# EAGLE design XIAO ESP32S3_v1.1 (EAGLE 9.6.2)
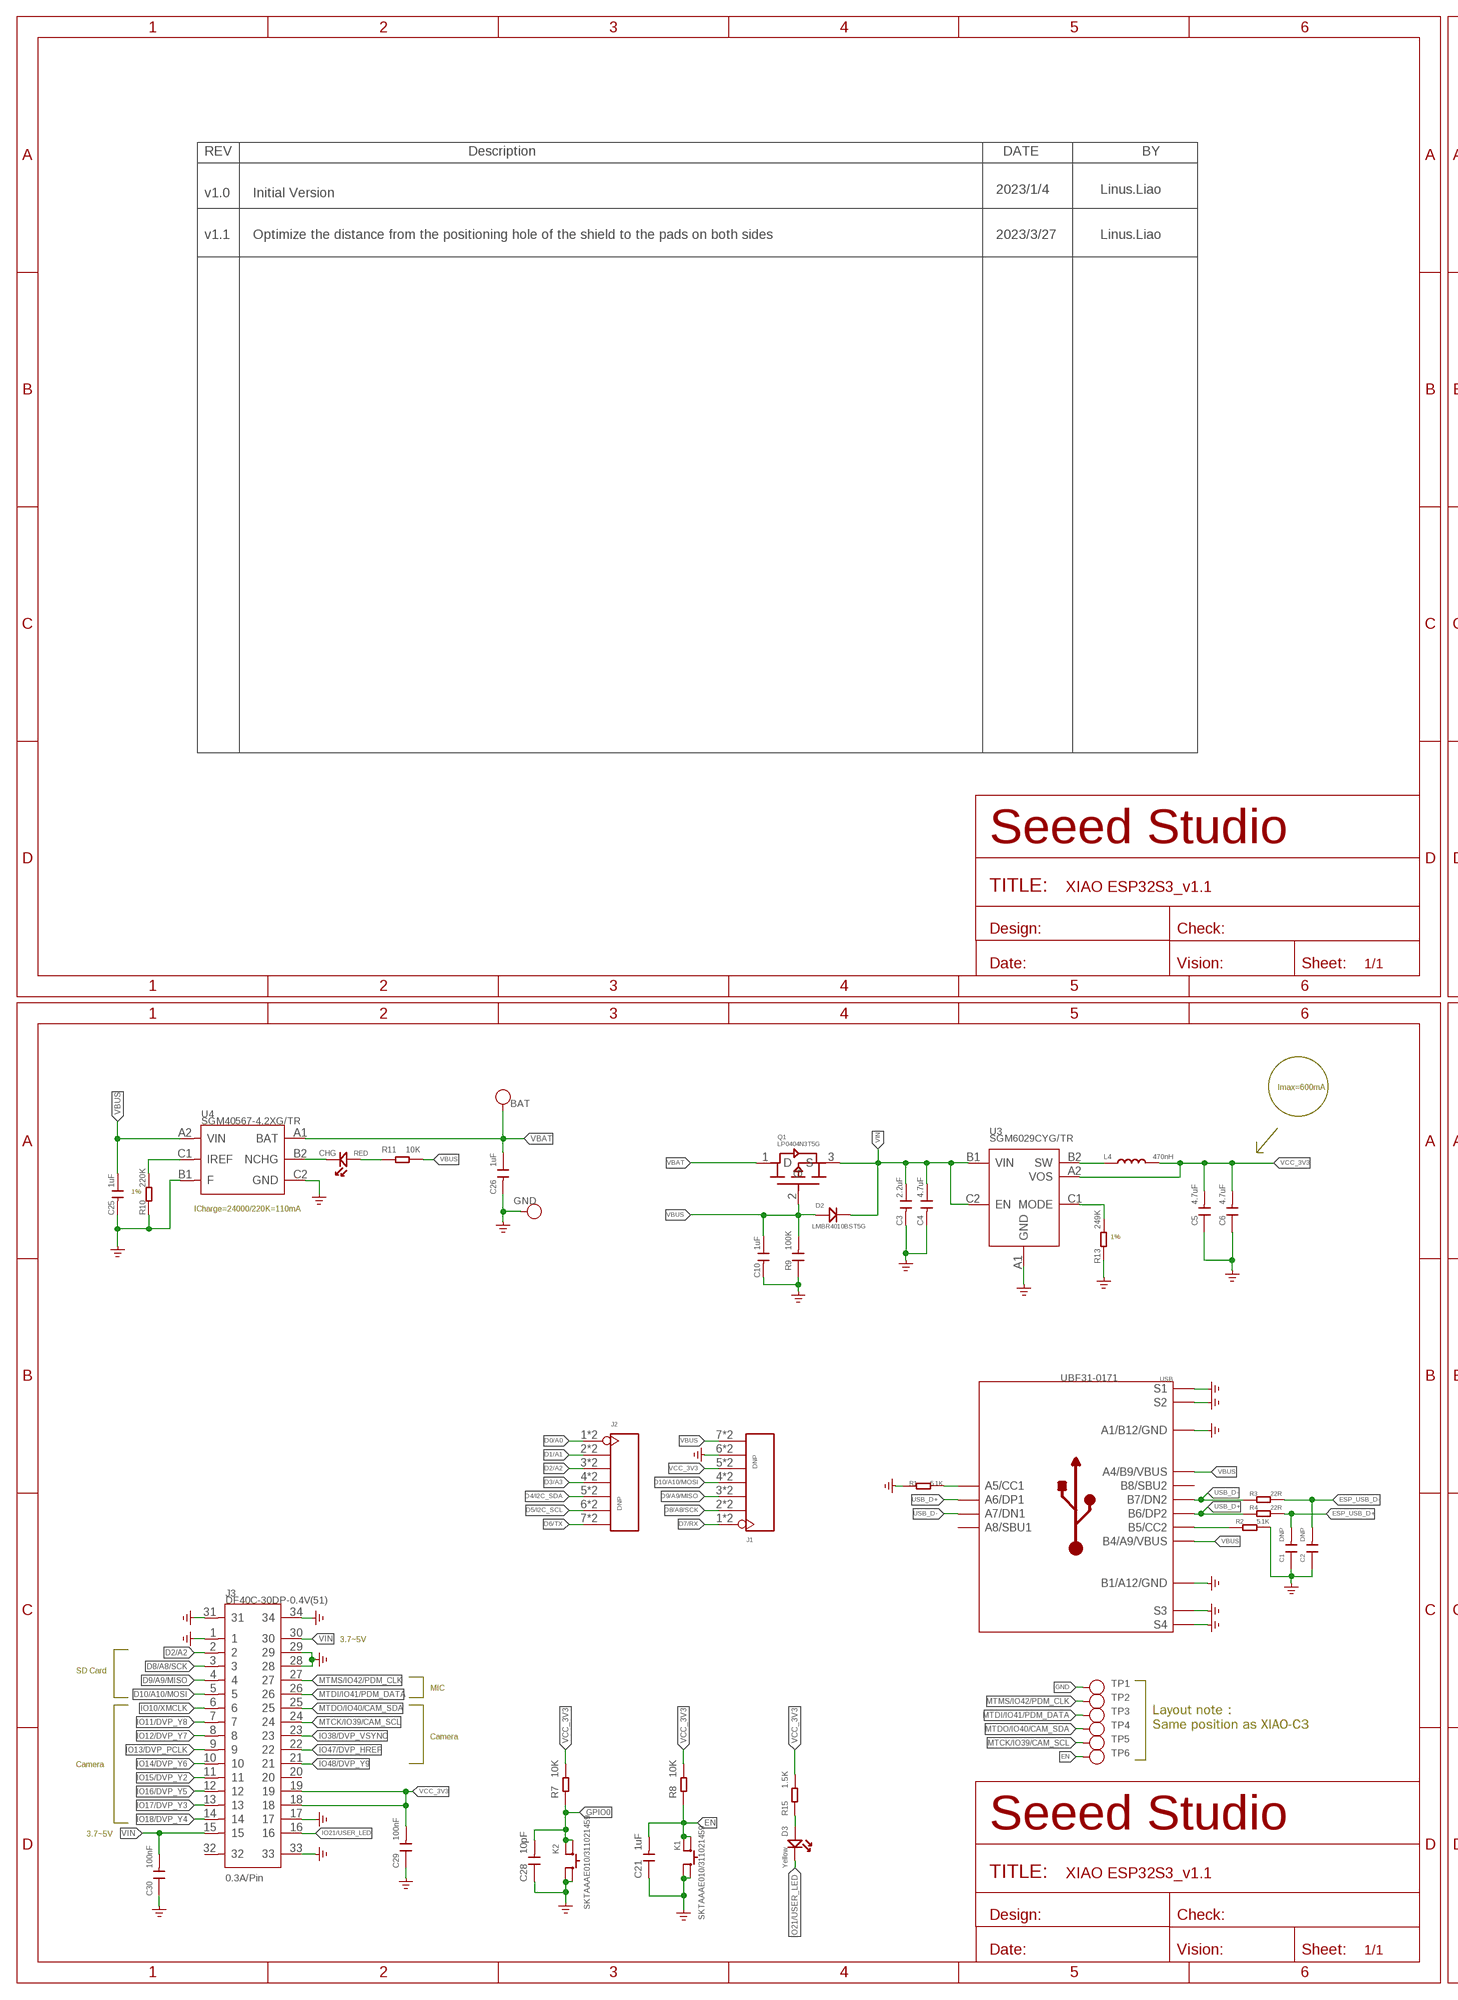
[diagram p0: schematic, sheet 1, part 1 of 2]
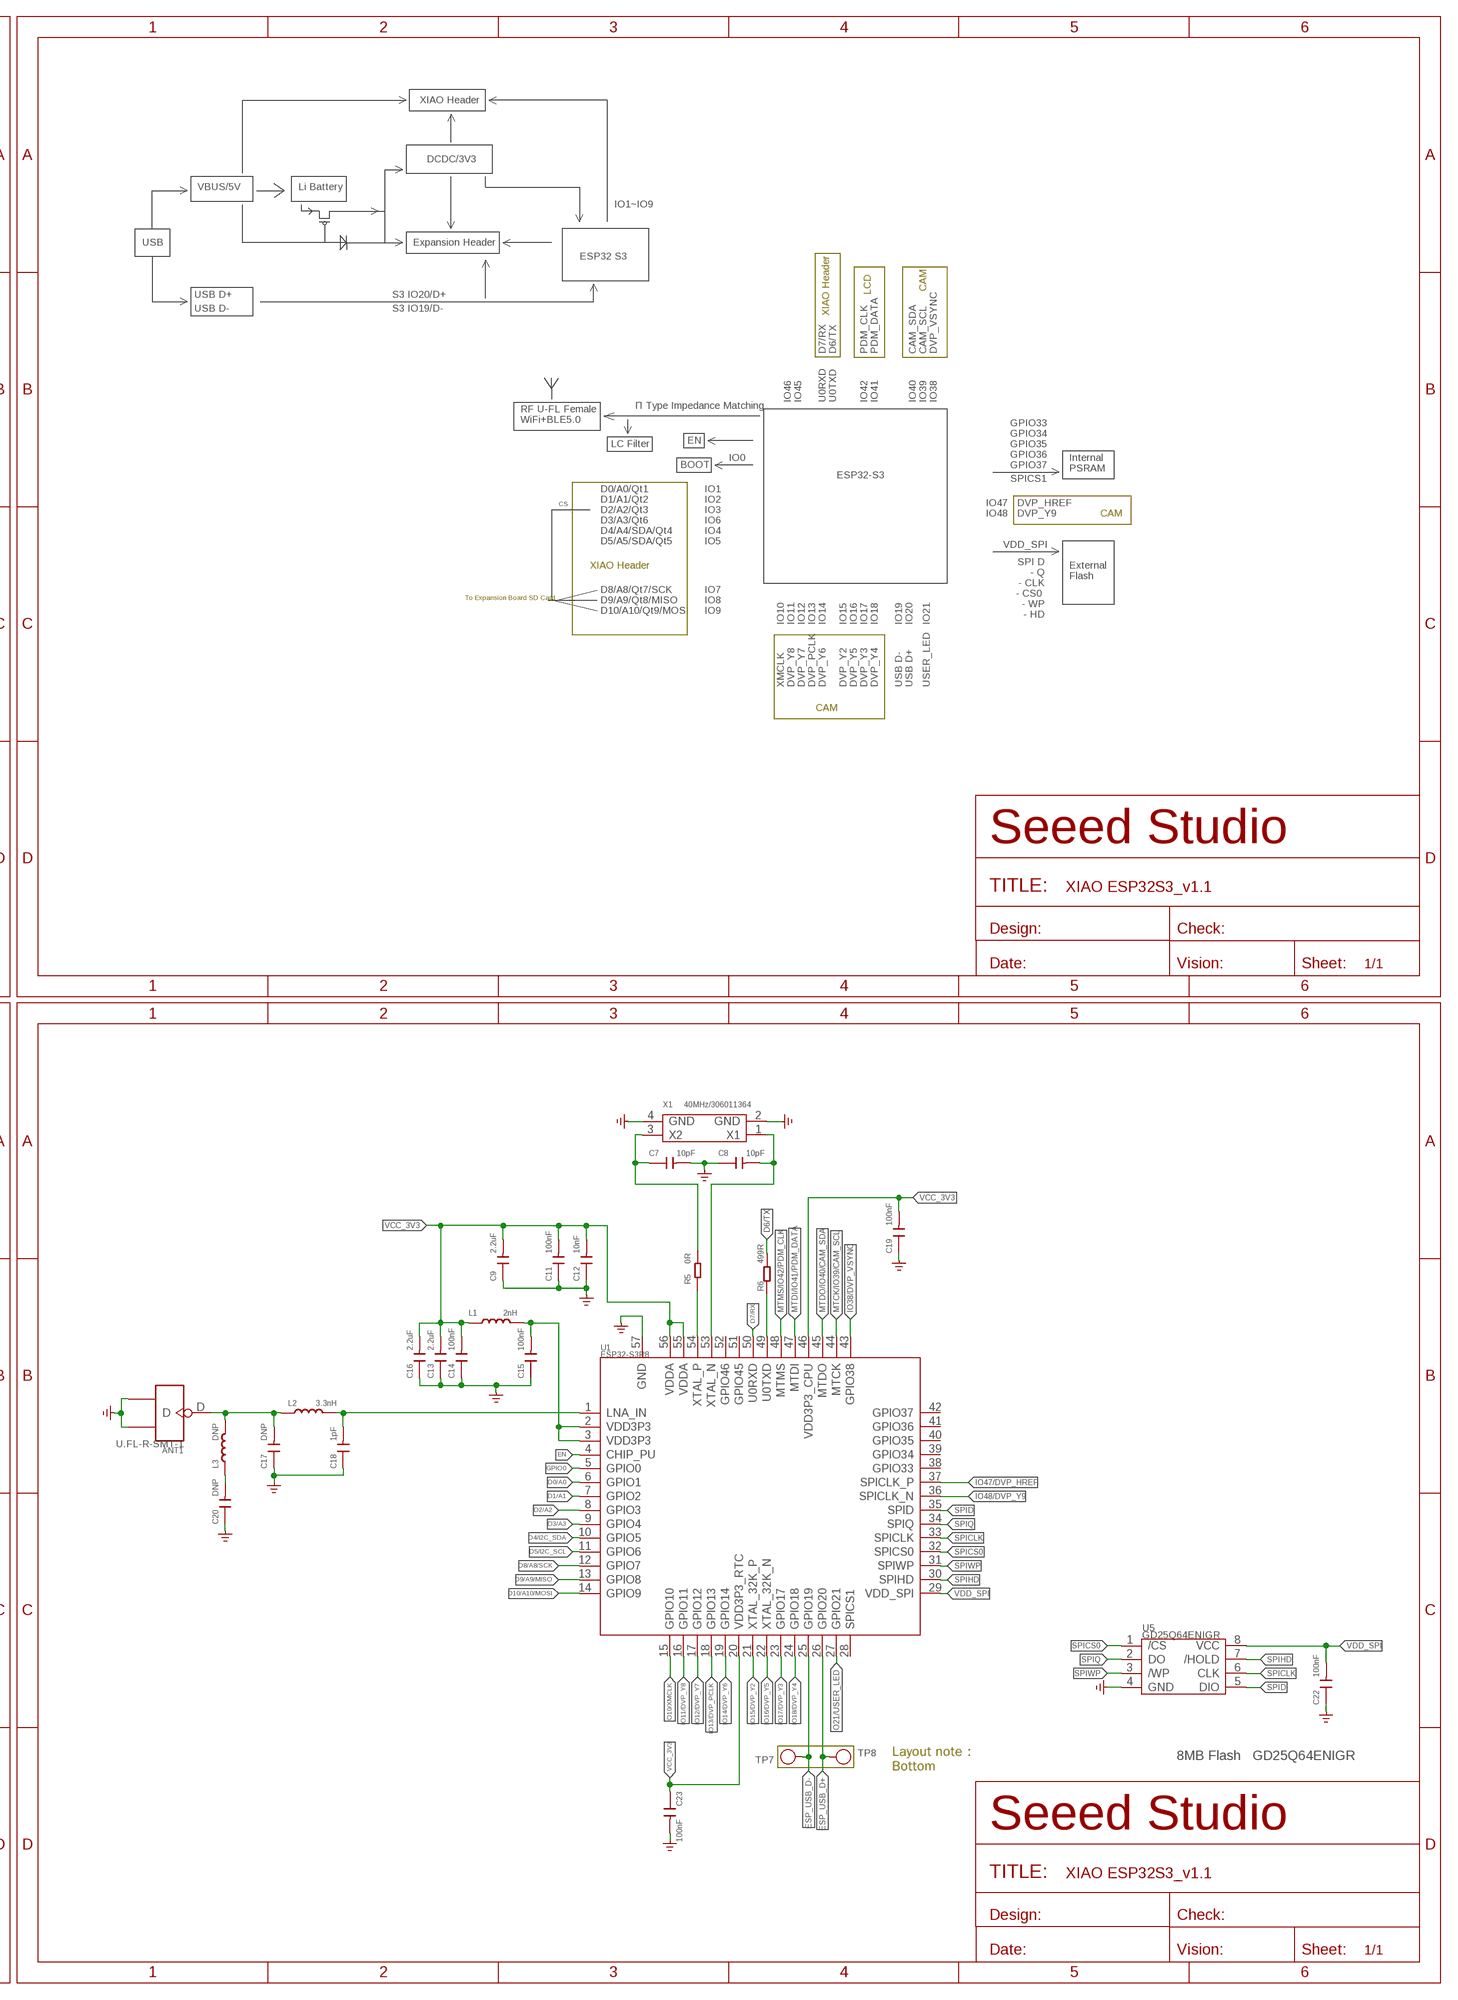
[diagram p1: schematic, sheet 1, part 2 of 2]

## Parts
ANT1  U.FL-R-SMT-1  ANTENNA-U-FL-320110048  [U-FL3P-SMD-2.6X2.6X1.0MM]
BAT  VBAT  TEST-POINT'4080'  [TP-80X40MIL]
C1  DNP  CAP-0201  [C0201]
C2  DNP  CAP-0201  [C0201]
C3  2.2uF  CAP-0201  [C0201]
C4  4.7uF  CAP-0201  [C0201]
C5  4.7uF  CAP-0201  [C0201]
C6  4.7uF  CAP-0201  [C0201]
C7  10pF  CAP-0201  [C0201]
C8  10pF  CAP-0201  [C0201]
C9  2.2uF  CAP-0201  [C0201]
C10  1uF  CAP-0201  [C0201]
C11  100nF  CAP-0201  [C0201]
C12  10nF  CAP-0201  [C0201]
C13  2.2uF  CAP-0201  [C0201]
C14  100nF  CAP-0201  [C0201]
C15  100nF  CAP-0201  [C0201]
C16  2.2uF  CAP-0201  [C0201]
C17  DNP  CAP-0201  [C0201]
C18  1pF  CAP-0201  [C0201]
C19  100nF  CAP-0201  [C0201]
C20  DNP  CAP-0201  [C0201]
C21  1uF  CAP-0201  [C0201]
C22  100nF  CAP-0201  [C0201]
C23  100nF  CAP-0201  [C0201]
C25  1uF  CAP-0201  [C0201]
C26  1uF  CAP-0201  [C0201]
C28  10pF  CAP-0201  [C0201]
C29  100nF  CAP-0201  [C0201]
C30  100nF  CAP-0201  [C0201]
CHG  RED  LED-0402  [LED-0402]
D2  LMBR4010BST5G  DIODEDFN1006(0402/SOD882)  [DFN1006-2L]
D3  Yellow  LED-0402  [LED-0402]
GND  GND  TEST-POINT'4080'  [TP-80X40MIL]
J1  DNP  HEADER-7P-HALF-HOLE-2.54  [H7-HALF-HOLE-2.54]
J2  DNP  HEADER-7P-HALF-HOLE-2.54  [H7-HALF-HOLE-2.54]
J3  DF40C-30DP-0.4V(51)  BTB-P4S30-HEAD  [BTB30-0.4-7.52X2.97X1.14]
K1  SKTAAAE010/311021459  BUTTON-4P  [SW4-SMD-2.8-2.6X1.6X0.53MM]
K2  SKTAAAE010/311021459  BUTTON-4P  [SW4-SMD-2.8-2.6X1.6X0.53MM]
L1  2nH  INDUCTOR-0201  [L0201]
L2  3.3nH  INDUCTOR-0201  [L0201]
L3  DNP  INDUCTOR-0201  [L0201]
L4  470nH  L-0603  [L0603]
Q1  LP0404N3T5G  PMOS_1.00.60.35MM  [PMOS_1.0*0.6*0.35MM]
R1  5.1K  RES-0201  [R0201]
R2  5.1K  RES-0201  [R0201]
R3  22R  RES-0201  [R0201]
R4  22R  RES-0201  [R0201]
R5  0R  RES-0201  [R0201]
R6  499R  RES-0201  [R0201]
R7  10K  RES-0201  [R0201]
R8  10K  RES-0201  [R0201]
R9  100K  CAP-0201  [C0201]
R10  220K  RES-0201  [R0201]
R11  10K  RES-0201  [R0201]
R13  249K  RES-0201  [R0201]
R15  1.5K  RES-0201  [R0201]
TP1  TEST-POINT'4545'  [TP-D45MIL]
TP2  TEST-POINT'4545'  [TP-D45MIL]
TP3  TEST-POINT'4545'  [TP-D45MIL]
TP4  TEST-POINT'4545'  [TP-D45MIL]
TP5  TEST-POINT'4545'  [TP-D45MIL]
TP6  TEST-POINT'4545'  [TP-D45MIL]
TP7  TEST-POINT'4545'  [TP-D45MIL]
TP8  TEST-POINT'4545'  [TP-D45MIL]
U1  ESP32-S3R8  MCU-ESP32-S3  [QFN56G-0.4-7X7MM]
U3  SGM6029CYG/TR  PMIC-SGM6029  [BGA6-0.35-0.745X10.95X0.4MM]
U4  SGM40567-4.2XG/TR  PMIC-SGM40567  [WLCSP-0.4-0.92X1.16X0.4MM]
U5  GD25Q64ENIGR  FLASH-W25X80-FZBIHO  [USON8-0.8-4X3MM]
USB  UBF31-0171  USB2.0-TYPE-C  [USB2.0-TYPE-C]
X1  40MHz/306011364  CRYSTAL-4P-1612  [X4-SMD-1.6X1.2X0.35MM]

## Nets
D0/A0: J2.1 J2.13 U1.6(GPIO1)
D1/A1: J2.2 J2.14 U1.7(GPIO2)
D2/A2: J2.3 J2.15 J3.2 U1.8(GPIO3)
D3/A3: J2.4 J2.16 U1.9(GPIO4)
D4/I2C_SDA: J2.5 J2.17 U1.10(GPIO5)
D5/I2C_SCL: J2.6 J2.18 U1.11(GPIO6)
D6/TX: J2.7 J2.19 R6.2
D7/RX: J1.1 J1.13 U1.50(U0RXD)
D8/A8/SCK: J1.2 J1.14 J3.3 U1.12(GPIO7)
D9/A9/MISO: J1.3 J1.15 J3.4 U1.13(GPIO8)
D10/A10/MOSI: J1.4 J1.16 J3.5 U1.14(GPIO9)
EN: C21.2 K1.1(A0) K1.3(A1) R8.1 TP6.T U1.4(CHIP_PU)
ESP_USB_D+: C1.2 R4.2 TP8.T U1.26(GPIO20)
ESP_USB_D-: C2.2 R3.2 TP7.T U1.25(GPIO19)
GND: ANT1.GND1 ANT1.GND2 C1.1 C2.1 C3.2 C4.2 C5.1 C6.1 C7.2 C8.1 C9.1 C10.2 C11.1 C12.1 C13.1 C14.1 C15.1 C16.1 C17.1 C18.1 C19.1 C20.1 C21.1 C22.1 C23.2 C25.2 C26.2 C28.1 C29.1 C30.1 GND.1(T) J1.6 J1.18 J3.1 J3.17 J3.28 J3.29 J3.31 J3.33 J3.34 K1.2(B0) K1.4(B1) K2.2(B0) K2.4(B1) R1.1 R2.2 R9.1 R10.1 R13.1 TP1.T U1.57(GND) U3.A1(GND) U4.B1(F) U4.C2(GND) U5.4(GND) USB.A1_B12(A1/B12/GND) USB.B1_A12(B1/A12/GND) USB.S1 USB.S2 USB.S3 USB.S4 USB.S5(S1) USB.S6(S2) X1.2(GND) X1.4(GND) ; supply symbol labelled GND_POWER
GPIO0: C28.2 K2.1(A0) K2.3(A1) R7.1 U1.5(GPIO0)
IO10/XMCLK: J3.6 U1.15(GPIO10)
IO11/DVP_Y8: J3.7 U1.16(GPIO11)
IO12/DVP_Y7: J3.8 U1.17(GPIO12)
IO13/DVP_PCLK: J3.9 U1.18(GPIO13)
IO14/DVP_Y6: J3.10 U1.19(GPIO14)
IO15/DVP_Y2: J3.11 U1.21(XTAL_32K_P)
IO16/DVP_Y5: J3.12 U1.22(XTAL_32K_N)
IO17/DVP_Y3: J3.13 U1.23(GPIO17)
IO18/DVP_Y4: J3.14 U1.24(GPIO18)
IO21/USER_LED: D3.- J3.16 U1.27(GPIO21)
IO38/DVP_VSYNC: J3.23 U1.43(GPIO38)
IO47/DVP_HREF: J3.22 U1.37(SPICLK_P)
IO48/DVP_Y9: J3.21 U1.36(SPICLK_N)
MTCK/IO39/CAM_SCL: J3.24 TP5.T U1.44(MTCK)
MTDI/IO41/PDM_DATA: J3.26 TP3.T U1.47(MTDI)
MTDO/IO40/CAM_SDA: J3.25 TP4.T U1.45(MTDO)
MTMS/IO42/PDM_CLK: J3.27 TP2.T U1.48(MTMS)
N$1: R5.1 U1.54(XTAL_P)
N$2: C7.1 R5.2 X1.3(X2)
N$3: C8.2 U1.53(XTAL_N) X1.1(X1)
N$4: L4.1 U3.B2(SW)
N$5: ANT1.D C17.2 L2.1 L3.2
N$6: R2.1 USB.B5(B5/CC2)
N$7: C15.2 L1.2 U1.2(VDD3P3) U1.3(VDD3P3)
N$8: R1.2 USB.A5(A5/CC1)
N$9: C18.2 L2.2 U1.1(LNA_IN)
N$10: CHG.- U4.B2(NCHG)
N$11: R6.1 U1.49(U0TXD)
N$13: R10.2 U4.C1(IREF)
N$14: CHG.+ R11.2
N$15: D3.+ R15.1
N$16: R13.2 U3.C1(MODE)
N$28: C20.2 L3.1
SPICLK: U1.33(SPICLK) U5.6(CLK)
SPICS0: U1.32(SPICS0) U5.1(/CS)
SPID: U1.35(SPID) U5.5(DIO)
SPIHD: U1.30(SPIHD) U5.7(/HOLD)
SPIQ: U1.34(SPIQ) U5.2(DO)
SPIWP: U1.31(SPIWP) U5.3(/WP)
USB_D+: R4.1 USB.A6(A6/DP1) USB.B6(B6/DP2)
USB_D-: R3.1 USB.A7(A7/DN1) USB.B7(B7/DN2)
VBAT: BAT.1(T) C26.1 Q1.1(D) U4.A1(BAT)
VBUS: C10.1 C25.1 D2.+ J1.7 J1.19 Q1.2(G) R9.2 R11.1 U4.A2(VIN) USB.A4_B9(A4/B9/VBUS) USB.B4_A9(B4/A9/VBUS)
VCC_3V3: C5.2 C6.2 C9.2 C11.2 C12.2 C13.2 C14.2 C16.2 C19.2 C23.1 C29.2 J1.5 J1.17 J3.18 J3.19 L1.1 L4.2 R7.2 R8.2 R15.2 U1.20(VDD3P3_RTC) U1.46(VDD3P3_CPU) U1.55(VDDA) U1.56(VDDA) U3.A2(VOS)
VDD_SPI: C22.2 U1.29(VDD_SPI) U5.8(VCC)
VIN: C3.1 C4.1 C30.2 D2.- J3.15 J3.30 Q1.3(S) U3.B1(VIN) U3.C2(EN)
Unconnected: J3.20 J3.32 U1.28(SPICS1) U1.38(GPIO33) U1.39(GPIO34) U1.40(GPIO35) U1.41(GPIO36) U1.42(GPIO37) U1.51(GPIO45) U1.52(GPIO46) USB.A8(A8/SBU1) USB.B8(B8/SBU2)

## Notes on the sheet
- XIAO Header
- DCDC/3V3
- VBUS/5V | Li Battery
- v1.0 | Initial Version | 2023/1/4 | Linus.Liao
- IO1~IO9
- v1.1 | Optimize the distance from the positioning hole of the shield to the pads on both sides | 2023/3/27 | Linus.Liao
- USB | Expansion Header
- ESP32 S3
- CAM
- LCD
- USB D+ | S3 IO20/D+
- USB D- | S3 IO19/D-
- XIAO Header
- D7/RX | D6/TX | PDM_CLK | PDM_DATA | CAM_SDA | CAM_SCL | DVP_VSYNC
- IO46 | IO45 | U0RXD | U0TXD | IO42 | IO41 | IO40 | IO39 | IO38
- Π Type Impedance Matching
- RF U-FL Female
  WiFi+BLE5.0
- EN
- LC Filter
- IO0
- BOOT
- GPIO33
  GPIO34
  GPIO35
  GPIO36
  GPIO37
- Internal
  PSRAM
- ESP32-S3
- SPICS1
- D0/A0/Qt1 | IO1
- D1/A1/Qt2 | IO2
- CS | IO47 | DVP_HREF
- D2/A2/Qt3 | IO3
- IO48 | DVP_Y9 | CAM
- D3/A3/Qt6 | IO6
- D4/A4/SDA/Qt4 | IO4
- D5/A5/SDA/Qt5 | IO5
- VDD_SPI
- SPI D
       - Q
       - CLK
       - CS0 
       - WP
       - HD
- XIAO Header
- External 
  Flash
- D8/A8/Qt7/SCK | IO7
- To Expansion Board SD Card
- D9/A9/Qt8/MISO | IO8
- D10/A10/Qt9/MOSI | IO9
- IO10 | IO11 | IO12 | IO13 | IO14 | IO15 | IO16 | IO17 | IO18 | IO19 | IO20 | IO21
- XMCLK | DVP_Y8 | DVP_Y7 | DVP_PCLK | DVP_Y6 | DVP_Y2 | DVP_Y5 | DVP_Y3 | DVP_Y4 | USB D- | USB D+ | USER_LED
- CAM
- Imax=600mA
- 1%
- ICharge=24000/220K=110mA
- 1%
- 3.7~5V
- SD Card
- MIC
- Layout note：
  Same position as XIAO-C3
- Camera
- 8MB Flash   GD25Q64ENIGR
- Camera
- Layout note：
  Bottom
- 3.7~5V
- 0.3A/Pin

## Library data of the parts
ANT1 = Connector-new:ANTENNA-U-FL
BAT GND = Discrete-new:TEST-POINT
C1-C23 C25 C26 C28-C30 R9 = Discrete-new:CAP: Ceramic Capacitors
CHG D3 = Discrete-small:LED
D2 = dasd:DIODE
J1 J2 = Connector2:HEADER-7P-HALF-HOLE
J3 = Connect2:BTB-P4S30
K1 K2 = Making:BUTTON-4P
L1-L3 = Discrete-new:INDUCTOR
L4 = Discrete-small:L
Q1 = PMOS_1006:PMOS_1.0*0.6*0.35MM: MCC:SI3139KL3 TI:CSD25481F4
R1-R8 R10 R11 R13 R15 = Discrete-new:RES
TP1-TP8 = Discrete-new:TEST-POINT; PARTNO: DNP
U1 = iccc:MCU-ESP32-S3
U3 = PMIC:PMIC-SGM6029
U4 = PMIC:PMIC-SGM40567
U5 = IiC-new:FLASH-W25X80: 1M-BIT,2M-BIT,4M-BIT AND 8M-BIT SERIAL FLASH MEMORY WITH 4KB SECTORS AND DUAL OUTPUT SPI
USB = USB C:USB2.0-TYPE-C
X1 = Discrete-new:CRYSTAL-4P

## Net classes
0 default: width 0.089 mm, drill 0.2 mm, clearance 0.102 mm

## Board
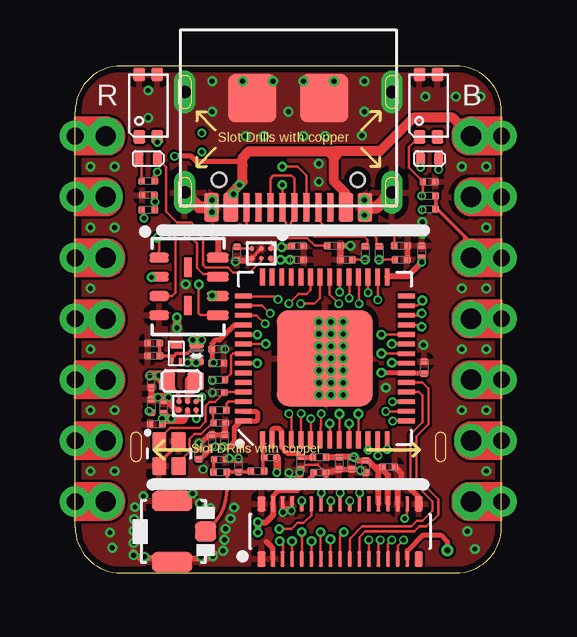
[diagram p2: board, top side]
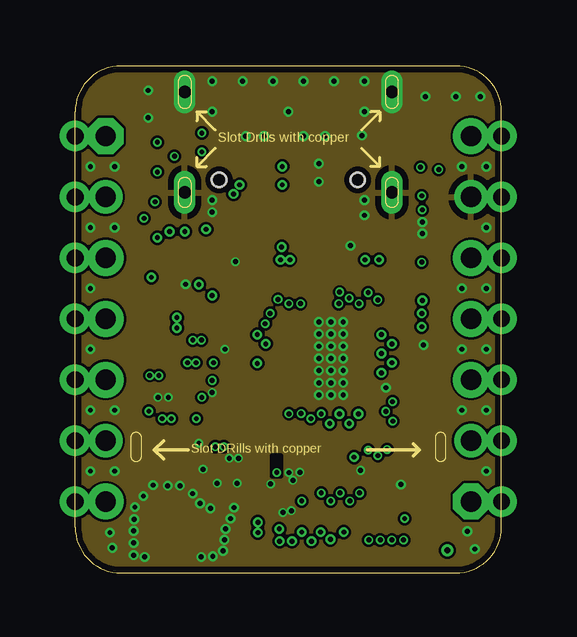
[diagram p3: board, inner layer Route2]
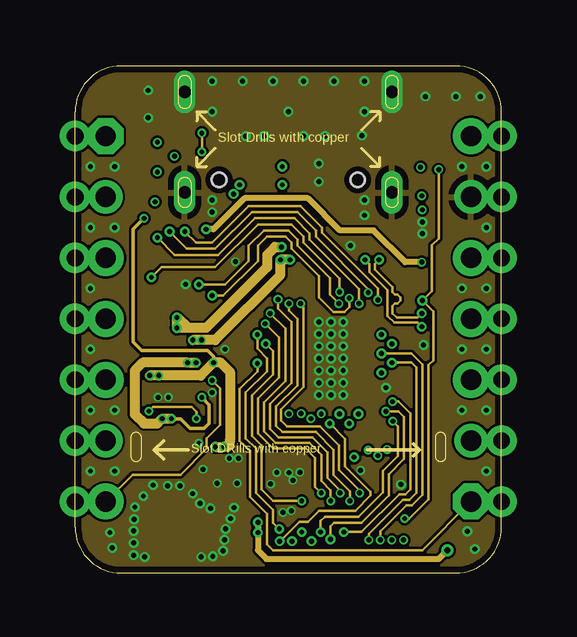
[diagram p4: board, inner layer Route15]
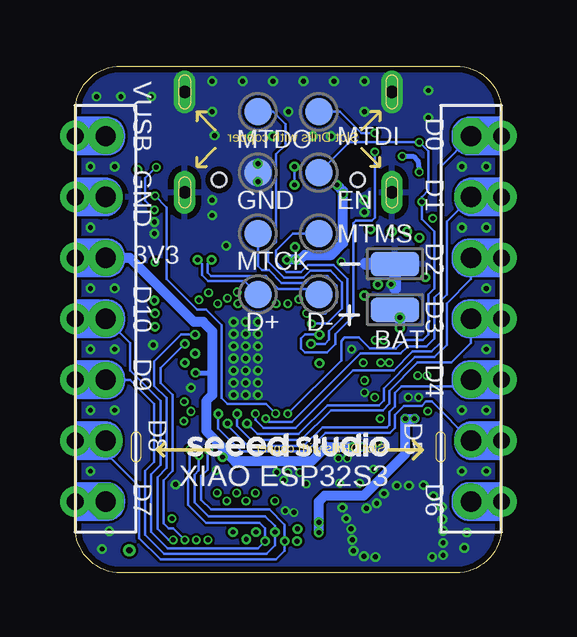
[diagram p5: board, bottom side, seen from below]

Size 17.78 x 21.13 mm. Coordinates in mm from the lower left corner, seen from the top.
Outline: 15.88,21.13 1.91,21.13 arc90 0,19.23 0,1.91 arc90 1.91,0 15.88,0 arc90 17.78,1.91 17.78,19.23 arc90 15.88,21.13
Copper layers (1*2*15*16): Top 0.035mm / dielectric 0.2mm / Route2 0.0175mm / dielectric 0.3mm / Route15 0.0175mm / dielectric 0.2mm / Bottom 0.035mm
Design rules "SeeedStudio_4layer_DRU_no_angle_20140221 *": minimum track width 1mil, minimum drill 8mil, track to track 4mil, track to pad 4mil, pad to pad 4mil, via to via 4mil, smd to smd 0mil, copper to edge 10mil, drill to drill 8mil, minimum pad ring 3mil, minimum via ring 3mil, stop-mask expansion 1mil, vias tented up to drill 25mil, thermal gap 10mil
Milling: area 15,4.6 to 15.4,5.9; area 2.3,4.6 to 2.7,5.9; 6 lines

### Footprints (pad centres in the part's own frame; a part is rotated, then mirrored left to right if it is on the bottom)
U-FL3P-SMD-2.6X2.6X1.0MM = smd 0.889 x 0.838: D -1.397,0 | smd 1.676 x 0.838: GND1 0,1.27; GND2 0,-1.27
TP-80X40MIL = smd 2.032 x 1.016: 1 0,0
C0201 = smd 0.279 x 0.318: 1 -0.255,0; 2 0.255,0
LED-0402 = smd 0.385 x 0.508: + -0.383,0; - 0.383,0
DFN1006-2L = smd 0.3 x 0.6: + 0.35,0; - -0.35,0
H7-HALF-HOLE-2.54 = drill 0.85 pad 1.5 octagon: 1 0,7.62 | drill 0.85 pad 1.4: 2 0,5.08; 6 0,-5.08 | drill 0.85 pad 1.5: 3 0,2.54; 4 0,0; 5 0,-2.54; 7 0,-7.62 | drill 0.7 pad 1.27: 13 -1.27,7.62; 14 -1.27,5.08; 15 -1.27,2.54; 16 -1.27,0; 17 -1.27,-2.54; 18 -1.27,-5.08; 19 -1.27,-7.62
BTB30-0.4-7.52X2.97X1.14 = smd 0.18 x 0.65: 1 -2.8,-1.15; 2 -2.4,-1.15; 3 -2,-1.15; 4 -1.6,-1.15; 5 -1.2,-1.15; 6 -0.8,-1.15; 7 -0.4,-1.15; 8 0,-1.15; 9 0.4,-1.15; 10 0.8,-1.15; 11 1.2,-1.15; 12 1.6,-1.15; 13 2,-1.15; 14 2.4,-1.15; 15 2.8,-1.15; 16 2.8,1.15; 17 2.4,1.15; 18 2,1.15; 19 1.6,1.15; 20 1.2,1.15; 21 0.8,1.15; 22 0.4,1.15; 23 0,1.15; 24 -0.4,1.15; 25 -0.8,1.15; 26 -1.2,1.15; 27 -1.6,1.15; 28 -2,1.15; 29 -2.4,1.15; 30 -2.8,1.15 | smd 0.35 x 0.66: 31 -3.275,-1.15; 32 3.275,-1.15 | smd 0.35 x 0.65: 33 3.275,1.15; 34 -3.275,1.15
SW4-SMD-2.8-2.6X1.6X0.53MM = smd 0.55 x 0.5: 1 -1.3,0.375; 2 1.3,0.375; 3 -1.3,-0.375; 4 1.3,-0.375
L0201 = smd 0.279 x 0.318: 1 -0.279,0; 2 0.279,0
L0603 = smd 0.696 x 0.762: 1 0.602,0; 2 -0.602,0
PMOS_1.0*0.6*0.35MM = smd 0.5 x 0.25: 1 0,0.325 | smd 0.15 x 0.25: 2 -0.175,-0.325; 3 0.175,-0.325
R0201 = smd 0.279 x 0.318: 1 -0.279,0; 2 0.279,0
TP-D45MIL = smd 1.143 x 1.143: T 0,0
QFN56G-0.4-7X7MM = smd 0.7 x 0.2: 1 -3.4,2.6; 2 -3.4,2.2; 3 -3.4,1.8; 4 -3.4,1.4; 5 -3.4,1; 6 -3.4,0.6; 7 -3.4,0.2; 8 -3.4,-0.2; 9 -3.4,-0.6; 10 -3.4,-1; 11 -3.4,-1.4; 12 -3.4,-1.8; 13 -3.4,-2.2; 14 -3.4,-2.6; 29 3.4,-2.6; 30 3.4,-2.2; 31 3.4,-1.8; 32 3.4,-1.4; 33 3.4,-1; 34 3.4,-0.6; 35 3.4,-0.2; 36 3.4,0.2; 37 3.4,0.6; 38 3.4,1; 39 3.4,1.4; 40 3.4,1.8; 41 3.4,2.2; 42 3.4,2.6 | smd 0.2 x 0.7: 15 -2.6,-3.4; 16 -2.2,-3.4; 17 -1.8,-3.4; 18 -1.4,-3.4; 19 -1,-3.4; 20 -0.6,-3.4; 21 -0.2,-3.4; 22 0.2,-3.4; 23 0.6,-3.4; 24 1,-3.4; 25 1.4,-3.4; 26 1.8,-3.4; 27 2.2,-3.4; 28 2.6,-3.4; 43 2.6,3.4; 44 2.2,3.4; 45 1.8,3.4; 46 1.4,3.4; 47 1,3.4; 48 0.6,3.4; 49 0.2,3.4; 50 -0.2,3.4; 51 -0.6,3.4; 52 -1,3.4; 53 -1.4,3.4; 54 -1.8,3.4; 55 -2.2,3.4; 56 -2.6,3.4 | smd 4 x 4: 57 0,0
BGA6-0.35-0.745X10.95X0.4MM = smd 0.22 x 0.22: A1 -0.175,0.35; A2 0.175,0.35; B1 -0.175,0; B2 0.175,0; C1 -0.175,-0.35; C2 0.175,-0.35
WLCSP-0.4-0.92X1.16X0.4MM = smd 0.2 x 0.2: A1 -0.2,0.4; A2 0.2,0.4; B1 -0.2,0; B2 0.2,0; C1 -0.2,-0.4; C2 0.2,-0.4
USON8-0.8-4X3MM = smd 0.8 x 0.4: 1 -1.2,1.2; 2 -1.2,0.4; 3 -1.2,-0.4; 4 -1.2,-1.2 | smd 0.9 x 0.4: 5 1.25,-1.2; 6 1.25,-0.4; 7 1.25,0.4; 8 1.25,1.2 | smd 0.3 x 0.8: BP1 0,0.8; BP2 0,-0.8
USB2.0-TYPE-C = smd 1.2 x 0.6: A1_B12 0.05,3.2; A4_B9 0.05,2.4; B1_A12 0.05,-3.2; B4_A9 0.05,-2.4 | smd 1.2 x 0.3: A5 0.05,1.25; A6 0.05,0.25; A7 0.05,-0.25; A8 0.05,-1.25; B5 0.05,-1.75; B6 0.05,-0.75; B7 0.05,0.75; B8 0.05,1.75 | drill 0.508 pad 0.889 long: S1 -4.763,4.318; S2 -4.763,-4.318; S3 -0.572,4.318; S4 -0.572,-4.318 | smd 2 x 2: S5 -4.5,1.5; S6 -4.5,-1.5 | hole 0.6: -1.1,-2.89; -1.1,2.89
X4-SMD-1.6X1.2X0.35MM = smd 0.75 x 0.6: 1 -0.525,-0.4; 2 0.525,-0.4; 3 0.525,0.4; 4 -0.525,0.4

### Placement (x,y rotation side)
ANT1  4.04,1.73 180 top
BAT  4.45,10.97 0 bottom
C1  13.59,13.06 180 top
C2  11.3,13.06 0 top
C3  3.69,6.93 90 top
C4  3.38,6.2 180 top
C5  5.95,8.74 180 top
C6  3.17,7.98 90 top
C7  6.02,6.26 0 top
C8  5.97,7.52 0 top
C9  5.16,4.99 270 top
C10  3.28,9.06 180 top
C11  6.23,5.5 270 top
C12  5.71,5.5 270 top
C13  11.53,4.57 90 top
C14  11.01,4.57 90 top
C15  9.41,4.58 90 top
C16  12.12,4.44 90 top
C17  6.81,4.46 270 top
C18  8.14,4.82 180 top
C19  5.95,9.32 180 top
C20  6.04,4.73 180 top
C21  3.05,15.75 0 top
C22  14.45,13.39 270 top
C23  14.55,8.56 90 top
C25  9.28,13.06 0 top
C26  9.28,13.63 0 top
C28  14.76,16.31 180 top
C29  13.08,4.42 180 top
C30  10.2,4.19 180 top
CHG  3.05,17.27 0 top
D2  5.06,9.16 90 top
D3  14.78,17.27 0 top
GND  4.45,12.88 0 bottom
J1  16.51,10.59 180 top
J2  1.27,10.59 0 top
J3  11.05,1.73 0 top
K1  3.05,19.48 90 top
K2  14.73,19.48 90 top
L1  10.2,4.83 180 top
L2  7.6,4.24 0 top
L3  6.05,4.2 0 top
L4  4.43,8 0 top
Q1  4.21,9.15 0 top
R1  13.59,13.64 180 top
R2  10.79,13.64 0 top
R3  12.09,13.34 270 top
R4  12.67,13.34 270 top
R5  6.02,6.78 180 top
R6  5.97,8.06 180 top
R7  14.76,15.72 0 top
R8  3.05,15.14 180 top
R9  3.28,9.58 0 top
R10  6.75,13.31 90 top
R11  3.05,16.33 180 top
R13  3.17,6.96 270 top
R15  14.76,15.17 0 top
TP1  10.16,16.69 270 bottom
TP2  7.62,14.15 180 bottom
TP3  7.62,19.23 180 bottom
TP4  10.16,19.23 270 bottom
TP5  10.16,14.15 270 bottom
TP6  7.62,16.69 270 bottom
TP7  7.62,11.61 180 bottom
TP8  10.16,11.61 180 bottom
U1  10.41,8.94 90 top
U3  4.68,6.97 90 top
U4  7.76,13.32 270 top
U5  4.7,11.94 0 top
U$7  [LOGO-SEEED-NEW-0.94X8.4MM]  13.08,4.88 0 bottom
USB  8.89,15.29 270 top
X1  3.91,4.98 270 top

### Tracks (layer width: path | path; a pad name or v marks a point on that pad's centre or on a via)
D0/A0  (via drill 0.2 pad 0.36)
  Top 0.102: U1.6 9.83,5.56 v9.83,6.43
  Bottom 0.102: J2.13 J2.1 2.54,16.94 2.54,11.74 2.79,11.48 2.79,9.78 3.12,9.45 3.91,9.45 4.22,9.15 5.89,9.15 8.74,6.3 9.7,6.3 v9.83,6.43
D1/A1  (via drill 0.2 pad 0.36)
  Top 0.102: U1.7 v10.26,6.63
  Bottom 0.102: J2.14 J2.2 2.29,14.66 2.29,11.61 2.54,11.36 2.54,9.6 2.92,9.22 3.71,9.22 4.5,8.44 6.2,8.44 8.59,6.05 9.93,6.05 10.26,6.38 v10.26,6.63
D2/A2  (via drill 0.2 pad 0.41)
  Top 0.102: J3.2 8.66,0.79 8.66,1.2 v8.53,1.32 | U1.8 v10.62,6.22
  Route15 0.102: v8.53,1.32 8.54,1.32 9.35,2.13 9.7,2.13 10.16,2.59 11.68,2.59 12.32,3.23 12.32,3.38 11.25,4.45 11.25,5.59 v10.62,6.22
  Bottom 0.102: J2.15 J2.3 1.27,12.24 2.29,11.23 2.29,9.5 2.79,8.99 3.61,8.99 4.9,7.7 4.9,7.19 5.1,6.99 7.26,6.99 8.46,5.79 10.19,5.79 v10.62,6.22
D3/A3  (via drill 0.2 pad 0.41)
  Top 0.102: U1.9 v11.02,6.63
  Bottom 0.102: v11.02,6.63 11.02,6.12 10.44,5.54 8.36,5.54 7.11,6.78 4.95,6.78 4.67,7.06 4.67,7.6 3.5,8.77 2.08,8.77 1.27,9.58 J2.4 J2.16
D4/I2C_SDA  (via drill 0.2 pad 0.41)
  Top 0.102: U1.10 11.43,5.56 v11.43,6.22
  Bottom 0.102: v11.43,6.22 11.43,6.15 10.57,5.29 8.26,5.29 7.47,6.07 7.06,6.07 7.01,6.07 4.77,6.07 4.67,6.17 4.67,6.71 4.45,6.94 4.45,7.49 4.17,7.78 1.75,7.78 1.47,8.05 J2.5 J2.17
D5/I2C_SCL  (via drill 0.2 pad 0.41)
  Top 0.102: U1.11 v11.81,6.63
  Bottom 0.102: v11.81,6.63 11.81,6.02 10.85,5.06 8.13,5.06 7.34,5.84 4.65,5.84 4.45,6.05 4.45,6.58 4.06,6.96 3.33,6.96 3.15,7.14 2.9,7.14 J2.6 J2.18
D6/TX  (via drill 0.2 pad 0.36)
  Top 0.102: R6.2 v5.71,8.02
  Route15 0.102: J2.7 2.39,4.09 4.39,4.09 5.49,5.18 5.49,5.62 6.04,6.17 6.04,7.69 v5.71,8.02
  Bottom 0.102: J2.7 J2.19
D7/RX  (via drill 0.2 pad 0.41)
  Top 0.102: U1.50 v7.59,8.74
  Route15 0.102: v7.59,8.74 7.59,8.41 6.86,7.67 6.86,5.51 7.23,5.15 7.29,5.08 7.29,3.18 8,2.47 8,1.2 8.26,0.94 14.48,0.94 J1.1
  Bottom 0.102: J1.1 J1.13
D8/A8/SCK  (via drill 0.2 pad 0.36, 0.2 pad 0.41)
  Top 0.102: U1.12 12.19,5.52 12.22,5.5 v12.22,5.12 | J3.3 9.04,0.79 v9.04,1.32 | J1.2 J1.14
  Bottom 0.102: J1.2 16.51,5.01 15.11,3.61 15.11,1.45 14.22,0.56 9.4,0.56 9.04,0.92 v9.04,1.32 9.04,2.01 9.68,2.64 12.12,2.64 12.52,3.05 12.52,4.04 12.27,4.29 12.27,5.07 v12.22,5.12
D9/A9/MISO  (via drill 0.2 pad 0.36, 0.2 pad 0.41)
  Top 0.102: U1.13 12.6,5.53 12.62,5.5 v12.62,4.89 | J3.4 9.45,0.78 v9.45,1.7
  Bottom 0.102: J1.15 J1.3 15.49,8.05 14.48,7.04 14.48,4.63 14.86,4.24 14.86,1.58 14.07,0.79 9.8,0.79 9.45,1.15 v9.45,1.7 9.45,1.96 9.86,2.36 12.22,2.36 12.8,2.95 12.8,4.09 12.62,4.27 v12.62,4.89
D10/A10/MOSI  (via drill 0.2 pad 0.36, 0.2 pad 0.41)
  Top 0.102: U1.14 v13,5.14 | J3.5 9.86,0.79 v9.86,1.32
  Bottom 0.102: v13,5.14 13,4.29 13.08,4.22 13.08,2.85 12.32,2.09 10.08,2.09 9.86,1.86 v9.86,1.32 10.16,1.02 13.92,1.02 14.61,1.7 14.61,4.12 14.22,4.5 14.22,7.17 15.49,8.44 15.49,9.58 J1.4 J1.16
EN  (via drill 0.2 pad 0.36)
  Top 0.102: U1.4 9.02,6.53 v8.91,6.63 | K1.1 K1.3 v3.42,17.97 v3.43,17.96 | C21.2 3.33,15.73 v3.33,15.47 R8.1
  Bottom 0.102: TP6.T 6.35,17.96 v3.43,17.96 3.05,17.58 3.05,15.95 3.33,15.67 v3.33,15.47 3.33,14.76 2.79,14.23 2.79,11.86 3.05,11.61 3.05,9.93 3.28,9.71 4.04,9.71 4.39,9.35 5.49,9.35 5.94,9.81 6.55,9.81 6.68,9.68 6.68,8.87 v8.91,6.63
ESP_USB_D+  (via drill 0.2 pad 0.41)
  Top 0.102: C1.2 R4.2 | U1.26 14.37,10.74 v14.45,10.82
  Route15 0.102: v14.45,10.82 14.28,10.65 13.41,10.65 13.23,10.82 13.23,11.13 13.33,11.23 13.44,11.23 13.56,11.36 13.56,11.48 13.44,11.61 13.33,11.61 13.23,11.71 13.23,11.92 12.5,12.65 12.5,12.88 R4.2
  Bottom 0.102: R4.2 12.5,12.88 12.5,12.42 12.24,12.17 10.72,12.17 TP8.T
  other vias: 12.67,13.06
ESP_USB_D-  (via drill 0.2 pad 0.41)
  Top 0.102: R3.2 C2.2 11.53,13.08 | U1.25 14.37,10.34 v14.45,10.26
  Route15 0.102: v14.45,10.26 14.28,10.44 13.31,10.44 13.03,10.72 13.03,11.79 12.27,12.55 12.27,12.88 R3.2
  Bottom 0.102: TP7.T 7.85,11.84 9.3,11.84 9.83,12.37 11.35,12.37 11.4,12.37 12.12,12.37 12.27,12.52 12.27,12.88 R3.2
  other vias: 12.09,13.06
GND  (via drill 0.2 pad 0.36, 0.2 pad 0.41)
  Top 0.102: v5.71,15.55 5.71,15.27 USB.B1_A12 5.71,15.22 v5.71,15.04 | v12.06,15.55 12.06,15.27 USB.A1_B12 12.06,15.22 v12.06,14.91 | v6.25,9.32 6.21,9.3 C19.1 | 6.73,13.02 6.73,13.01 | C30.1 10.13,4.51 9.6,4.51 C15.1 9.41,4.28 8.99,3.86 8.97,3.86 | ANT1.GND1 4.04,0.59 4.06,0.61
  Top 0.127: 6.32,4.75 6.34,4.78 v6.43,4.78 | C17.1 v6.81,4.78 | C18.1 8.41,4.81
  Top 0.152: X1.4 4.31,5.38 3.51,4.58 X1.2 | U4.B1 7.33,13.09 | 8.66,2.72 8.66,2.87 J3.29 8.65,2.53 v8.66,2.52 | 8.66,2.72 v8.66,2.52 | J3.28 9.05,2.62 | 9.05,2.62 v9.02,2.59 8.94,2.52 v8.66,2.52 | 9.05,2.62 8.68,2.62 8.64,2.67 | 8.66,2.72 9.04,2.72
  Top 0.203: C1.1 13.87,13.08 R1.1 | 10.93,4.24 C14.1 11.05,4.32 C13.1 11.85,4.32 v11.9,4.28 | C30.1 10.48,3.74 10.92,3.74 | 3.94,7.04 3.77,7.2 | 3.77,7.2 C3.2 | 3.77,7.2 3.76,7.22 3.74,7.24 R13.1 | C15.1 9.41,4.08 9.09,3.76 8.41,3.76 | J3.1 8.25,1.02 7.98,1.3 | J3.33 14.32,3.13 13.79,3.66 | C16.1 12,4.18 11.94,4.24 | C9.1 v5.16,5.41 5.24,5.41 5.59,5.76 C12.1 C11.1 6.28,5.81 C7.2
  Top 0.229: U3.A1 4.21,6.79 3.94,7.04 | 3.94,7.04 3.76,7.22 | 3.94,7.04 3.94,7.27 v3.89,7.32 | R10.1 6.75,13.02 6.73,13.01
  Top 0.254: U4.C2 7.33,13.09 7.24,13.01 6.73,13.01 v6.68,12.98 | C30.1 11.05,4.32 | C2.1 11.07,13.08 R2.2 v11.48,13.64 | J3.17 13.45,3.54 v13.59,3.69 13.59,4.17 C29.1 | 2.41,0.89 2.69,0.61 4.06,0.61 5.61,0.61 5.82,0.82 | 6.32,4.75 C20.1 6.83,4.73 | C6.1 R13.1
  Top 0.33: 8.41,4.81 v8.41,4.19
  Top 0.356: v3.89,7.32 3.25,7.32
  Top 0.508: USB.A1_B12 12.57,15.24 13.21,15.88 13.21,15.8 | USB.B1_A12 5.18,15.24 4.57,15.85
  Bottom 0.508: 5.66,12.88 GND.1 4.45,11.86
  other vias: 5.71,7.52 10.16,10.47 11.18,10.47 10.67,10.47 11.18,9.96 11.18,9.45 11.18,8.94 11.18,8.44 11.18,7.93 10.67,7.93 10.67,8.44 10.16,8.44 10.16,7.93 10.16,8.94 10.67,8.94 10.67,9.45 10.67,9.96 10.16,9.96 10.16,9.45 11.18,7.42 10.67,7.42 10.16,7.42 0.64,9.32 0.64,6.78 0.64,4.24 1.65,4.24 1.65,6.78 0.64,11.86 0.64,14.4 1.65,14.4 0.64,16.94 1.65,16.94 17.15,4.24 17.15,6.78 16.13,6.78 16.13,9.32 17.15,9.32 17.15,11.86 16.13,11.86 17.15,14.4 17.15,16.94 16.13,16.94 4.9,3.3 4.37,3.63 3.86,3.63 2.46,2.24 2.44,1.75 2.44,1.25 5.71,20.5 5.71,19.23 6.98,20.5 8.26,20.5 9.53,20.5 10.79,20.5 12.06,20.5 12.06,19.23 8.89,19.23 9.53,18.21 10.41,18.21 10.16,17.07 10.16,16.31 7.11,18.21 7.87,18.21 3.05,20.12 3.05,18.98 14.61,19.87 15.88,19.87 16.89,19.87 4.61,12.03 6.27,1.83 6.22,1.37 3.45,7.32 14.53,9.5 14.48,14.15 11.96,18.24 2.84,3.2 2.49,2.75 3.25,3.66 8.15,3.71 14.48,14.63 16.36,1.73 16.66,0.99 2.44,0.74 1.45,1.68 1.55,1.04 2.9,0.66 6.48,2.26 6.63,2.72 6.17,0.92 5.74,0.69 5.26,0.66 5.64,2.69 5.21,2.9 6.76,3.74 5.92,3.74 12.95,7.72 5.33,4.32 9.37,4.19 9.08,3.86 8.92,4.18
  pour Route2: -0.38,23.17 17.78,23.17 19.94,21.01 19.94,0.94 18.54,-0.46 -1.91,-0.46 -2.54,0.18 -2.54,21.01
  pour Top (isolate 0.102, rank 6): -0.38,23.17 17.78,23.17 19.94,21.01 19.94,1.7 18.42,0.18 -1.91,0.18 -2.54,0.82 -2.54,21.01
  pour Bottom: -0.38,23.17 17.78,23.17 19.94,21.01 19.94,-0.84 19.05,-1.72 -1.91,-1.72 -2.54,-1.09 -2.54,21.01
  pour Route15: -0.38,23.17 17.78,23.17 19.94,21.01 19.94,-0.2 19.05,-1.09 -1.91,-1.09 -2.54,-0.46 -2.54,21.01
GPIO0  (via drill 0.2 pad 0.36)
  Top 0.102: U1.5 v9.42,6.64 | K2.3 K2.1 13.92,17.75 13.92,16.89 C28.2 14.5,15.75 R7.1 v14.45,15.72
  Bottom 0.102: v9.42,6.64 9.83,7.04 11.43,7.04 11.68,7.29 11.68,10.34 12.32,10.97 12.7,10.97 13.97,12.24 13.97,15.24 v14.45,15.72
IO10/XMCLK  (via drill 0.2 pad 0.36, 0.2 pad 0.41)
  Top 0.102: U1.15 13.8,6.33 v13.25,6.33 | J3.6 10.24,0.79 v10.24,1.7
  Route15 0.102: v10.24,1.7 10.24,2.16 10.41,2.34 11.81,2.34 12.83,3.36 12.83,4.24 13.46,4.88 13.46,6.11 v13.25,6.33
IO11/DVP_Y8  (via drill 0.2 pad 0.36, 0.2 pad 0.41)
  Top 0.102: J3.7 10.64,0.79 v10.64,1.4 | U1.16 13.8,6.73 v12.95,6.73
  Route15 0.102: v10.64,1.4 10.64,1.93 10.79,2.09 11.94,2.09 13.08,3.23 13.08,4.12 13.72,4.75 13.72,6.51 13.49,6.73 v12.95,6.73
IO12/DVP_Y7  (via drill 0.2 pad 0.36, 0.2 pad 0.41)
  Top 0.102: U1.17 v13.23,7.14 | J3.8 11.05,1.55 v11.2,1.7
  Route15 0.102: v11.2,1.7 11.94,1.7 13.51,3.28 13.77,3.28 13.97,3.48 13.97,6.66 13.49,7.14 v13.23,7.14
IO13/DVP_PCLK
  Top 0.102: U1.18 14.33,7.54 14.48,7.39 14.48,6.28 13.97,5.77 13.97,3.91 14.9,2.99 14.9,2.58 14.48,2.16 14.25,2.16 14.02,1.93 11.96,1.93 11.45,1.42 J3.9
IO14/DVP_Y6
  Top 0.102: U1.19 14.49,7.94 14.73,7.7 14.73,6.2 14.22,5.69 14.22,3.99 15.14,3.08 15.14,2.42 14.66,1.93 14.35,1.93 14.15,1.73 12.09,1.73 11.85,1.49 J3.10
IO15/DVP_Y2  (via drill 0.2 pad 0.36, 0.2 pad 0.41)
  Top 0.102: J3.11 12.24,0.79 v12.24,1.37 | U1.21 13.79,8.77 v13.21,8.77
  Route15 0.102: v12.24,1.37 12.24,1.63 13.66,3.05 13.95,3.05 14.22,3.33 14.22,8.56 14.02,8.77 v13.21,8.77
IO16/DVP_Y5  (via drill 0.2 pad 0.36, 0.2 pad 0.41)
  Top 0.102: U1.22 v12.78,9.15 | 12.65,0.78 J3.12 12.65,1.3 v12.72,1.37
  Route15 0.102: v12.78,9.15 14.02,9.15 14.48,8.69 14.48,3.25 14.05,2.82 13.82,2.82 12.72,1.73 v12.72,1.37
IO17/DVP_Y3  (via drill 0.2 pad 0.36, 0.2 pad 0.41)
  Top 0.102: U1.23 v13.21,9.55 | 13.06,0.79 J3.13 13.05,1.21 v13.21,1.37
  Bottom 0.102: v13.21,9.55 14.22,8.54 14.22,7.93 13.72,7.42 13.72,4.24 14.1,3.86 14.1,2.06 13.89,1.86 13.69,1.86 v13.21,1.37
IO18/DVP_Y4  (via drill 0.2 pad 0.36, 0.2 pad 0.41)
  Top 0.102: U1.24 13.8,9.93 v12.78,9.93 | 13.44,0.79 J3.14 13.45,1.13 v13.69,1.37
  Bottom 0.102: v12.78,9.93 13.36,9.93 14.48,8.82 14.48,7.8 13.97,7.29 13.97,4.37 14.35,3.99 14.35,1.83 13.89,1.37 v13.69,1.37
IO21/USER_LED  (via drill 0.2 pad 0.36, 0.2 pad 0.41)
  Top 0.102: U1.27 14.27,11.14 v14.48,11.36 | D3.- v15.16,16.82 | J3.16 13.84,2.36 v13.74,2.26
  Route15 0.102: v15.16,16.82 15.16,13.95 14.88,13.67 14.88,11.76 v14.48,11.36 14.94,10.9 14.94,8.87 14.73,8.66 14.73,3.08 13.92,2.26 v13.74,2.26
IO38/DVP_VSYNC  (via drill 0.2 pad 0.36)
  Top 0.102: U1.43 8.33,11.53 v8.46,11.41 | J3.23 v11.05,3.33
  Route15 0.102: v8.46,11.41 8.46,11.03 9.02,10.47 9.02,7.93 8.13,7.04 8.13,6 8.48,5.64 9.91,5.64 10.52,5.03 10.52,3.97 11.05,3.43 v11.05,3.33
IO47/DVP_HREF  (via drill 0.2 pad 0.36)
  Top 0.102: J3.22 11.46,2.69 v11.46,3 | U1.37 9.81,11.8 9.65,11.63 9.32,11.63 v8.91,11.23
  Route15 0.102: v11.46,3 11.46,3.41 10.77,4.09 10.77,5.13 10.03,5.87 8.64,5.87 8.38,6.12 8.38,6.94 9.27,7.83 9.27,10.59 8.91,10.95 v8.91,11.23
IO48/DVP_Y9  (via drill 0.2 pad 0.36)
  Top 0.102: J3.21 11.86,2.69 v11.86,3.33 | U1.36 10.21,11.46 9.98,11.23 v9.4,11.23
  Route15 0.102: v9.4,11.23 9.53,11.1 9.53,7.75 8.59,6.81 8.59,6.35 8.84,6.1 10.21,6.1 11,5.31 11,4.29 11.86,3.43 v11.86,3.33
MTCK/IO39/CAM_SCL  (via drill 0.2 pad 0.36)
  Top 0.102: J3.24 10.64,2.69 10.67,2.71 10.65,2.72 v10.65,3 | U1.44 7.8,11.15 v8.13,10.82
  Route15 0.102: v10.65,3 10.65,3.44 10.26,3.84 10.26,4.93 9.78,5.41 8.36,5.41 7.87,5.9 7.87,7.11 8.76,8 8.76,10.19 v8.13,10.82
  Bottom 0.102: TP5.T 10.16,12.8 9.98,12.63 9.7,12.63 9.17,12.09 8.18,12.09 7.9,12.37 7.26,12.37 6.88,11.99 6.88,11.28 7.34,10.82 v8.13,10.82
MTDI/IO41/PDM_DATA  (via drill 0.2 pad 0.36, 0.2 pad 0.41)
  Top 0.102: U1.47 7.02,9.93 v7.59,9.93 | 9.86,2.69 J3.26 9.85,2.41 9.53,2.09 9.27,2.09 9.02,1.83 v8.51,1.83
  Route15 0.102: v7.59,9.93 7.59,9.35 8,8.94 8,8.41 7.11,7.52 7.11,5.62 7.54,5.18 7.54,3.33 8.26,2.62 8.26,2.09 v8.51,1.83 | v5.28,17.55 v5.28,18.34
  Bottom 0.102: v7.59,9.93 8.2,9.93 8.36,9.78 8.36,9.35 8.2,9.2 7.29,9.2 6.93,9.55 6.93,9.96 6.17,10.72 6.17,14.58 6.07,14.68 5.41,14.68 5.28,14.81 v5.28,17.55 | v5.28,18.34 5.84,18.34 6.73,19.23 TP3.T
MTDO/IO40/CAM_SDA  (via drill 0.2 pad 0.36)
  Top 0.102: U1.45 7.57,10.74 v7.92,10.39 | J3.25 10.26,2.69 v10.26,3.33
  Route15 0.102: v7.92,10.39 8.51,9.81 8.51,8.16 7.62,7.27 7.62,5.82 8.26,5.18 9.63,5.18 10.01,4.8 10.01,3.58 v10.26,3.33
  Bottom 0.102: TP4.T 9.53,19.23 9.02,18.72 9.02,17.83 9.4,17.45 9.4,13.79 9.73,13.46 9.73,12.98 9.07,12.32 8.26,12.32 7.98,12.6 7.14,12.6 6.65,12.12 6.65,11.03 7.29,10.39 v7.92,10.39
MTMS/IO42/PDM_CLK  (via drill 0.2 pad 0.36, 0.2 pad 0.41)
  Top 0.102: U1.48 v7.95,9.55 | J3.27 v9.45,3
  Route15 0.102: v7.95,9.55 8.26,9.25 8.26,8.28 7.37,7.39 7.37,5.72 7.77,5.31 7.77,3.48 8.26,3 v9.45,3
  Bottom 0.102: v7.95,9.55 7.37,9.55 7.19,9.73 7.19,10.09 6.43,10.85 6.43,12.24 7.01,12.83 8.08,12.83 8.36,12.55 8.97,12.55 9.4,12.98 9.4,13.44 8.69,14.15 TP2.T
N$1
  Top 0.102: U1.54 6.4,7.14 6.3,7.04 R5.1
N$2
  Top 0.102: 5.74,6.76 R5.2 5.75,6.28 C7.1 5.72,6.26 5.26,5.79 4.98,5.79 4.77,5.59 4.77,5.06 4.31,4.59 X1.3 4.49,4.49
N$3
  Top 0.102: U1.53 6.25,7.54 C8.2 5.84,7.14 5.61,7.14 5.44,6.97 5.44,6.31 5.18,6.05 3.96,6.05 3.51,5.6 X1.1 3.68,5.51
N$4
  Top 0.229: U3.B2 4.68,7.35 | 4.68,7.35 4.68,7.47 | 4.68,7.47 4.68,7.72 | 4.68,7.72 L4.1 | 4.68,7.47 4.98,7.77 4.98,7.98 | 4.98,7.98 4.98,8.05 4.95,8.03 4.93,8.03 4.8,8.16 4.68,8.04 4.68,7.72 | 4.68,7.35 5.08,7.75 5.08,7.88 4.98,7.98
N$5
  Top 0.145: L2.1 7.29,4.21 C17.2 L3.2 | L3.2 | L3.2 6.33,3.48 arc-45 5.73,2.02 ANT1.D
N$6
  Top 0.102: USB.B5 7.14,14.53 7.27,14.4 8.26,14.4 8.69,13.97 9.68,13.97 10.01,13.64 R2.1
N$7
  Top 0.203: U1.2 8.21,5.98 8.26,6.02 8.51,6.02 8.61,5.92 U1.3 8.62,5.22 8.7,5.13 8.78,5.04 8.85,4.99 9.26,4.99 C15.2 L1.2
N$8
  Top 0.102: USB.A5 10.14,14.7 10.39,14.46 12.95,14.46 13.31,14.1 R1.2
N$9
  Top 0.102: U1.1
  Top 0.145: U1.1 7.83,5.52 7.83,5.02 7.83,4.87 | 7.83,4.87 C18.2 | 7.89,4.25 L2.2 7.83,4.28 7.83,4.87
N$10
  Top 0.102: U4.B2 7.75,13.11 7.75,13.01 7.26,12.52 6.58,12.52 6.37,12.73 5.44,12.73 5.33,12.83 5.33,13.95 5.02,14.26 5.02,14.43 4.85,14.61 4.24,14.61 3.79,15.07 3.79,16.92 CHG.-
N$11
  Top 0.102: U1.49 6.58,9.14 6.5,9.07 6.5,8.31 R6.1
N$12
  cutout Top: 8.18,4.98 8.66,4.98 8.71,4.93 8.71,3.99 8.66,3.94 8.18,3.94 8.13,3.99 8.13,4.93
N$13
  Top 0.102: U4.C1 6.81,13.53 R10.2
N$14
  Top 0.102: CHG.+ 2.77,17.17 R11.2
N$15  (via drill 0.2 pad 0.36)
  Top 0.102: R15.1 v14.48,15.14 | D3.+ v14.4,16.92
  Bottom 0.102: v14.4,16.92 14.86,16.46 14.86,15.52 v14.48,15.14
N$16  (via drill 0.2 pad 0.36)
  Top 0.102: U3.C1 5.05,6.77 v5.05,6.43 | R13.2 v3.07,6.74
  Route15 0.102: v5.05,6.43 5.05,6.71 4.85,6.91 3.24,6.91 v3.07,6.74
N$17
  cutout Route2: 18.03,16.56 18.8,16.56 19.18,16.18 19.18,14.79 18.03,14.79
N$18
  cutout Top: 18.03,16.56 18.8,16.56 19.18,16.18 19.18,14.79 18.03,14.79
N$19
  cutout Bottom: 18.03,16.56 18.8,16.56 19.18,16.18 19.18,14.79 18.03,14.79
N$20
  cutout Route15: 18.03,16.56 18.8,16.56 19.18,16.18 19.18,14.79 18.03,14.79
N$21
  cutout Top: 2.84,2.57 5.36,2.57 5.36,0.89 2.84,0.89
N$22
  cutout Route2: 8.18,4.98 8.61,4.98 8.66,4.93 8.66,3.99 8.61,3.94 8.18,3.94 8.13,3.99 8.13,4.93
N$23
  cutout Top: 5.71,4.04 5.75,4.51 5.68,4.45 5.68,4.08
N$24
  cutout Top: 6.86,3.96 8.18,3.96 8.28,4.07 8.28,4.29 8.15,4.42 5.71,4.42 5.61,4.32 5.61,4.04 5.71,3.94 6.45,3.94 6.48,3.96
N$28
  Top 0.145: L3.1 5.77,4.71 C20.2
SPICLK  (via drill 0.2 pad 0.36, 0.2 pad 0.41)
  Top 0.102: U1.33 11.43,12.33 v11.43,11.46 | v5.71,11.56 5.93,11.56 U5.6
  Route15 0.102: v5.71,11.56 6.18,11.56 7.62,13.01 7.62,13.64 8,14.02 8.76,14.02 9.02,13.77 9.02,13.52 10.16,12.37 10.16,11.48 10.77,10.87 11.23,10.87 11.43,11.08 v11.43,11.46
SPICS0  (via drill 0.2 pad 0.36, 0.2 pad 0.41)
  Top 0.102: 3.45,13.96 v3.43,13.98 3.5,13.91 U5.1 | U1.32 11.84,12.31 v11.84,11.23
  Route15 0.102: v3.43,13.98 4.14,13.26 5.97,13.26 7.49,14.79 9.14,14.79 9.78,14.15 9.78,13.9 11.84,11.84 v11.84,11.23
SPID  (via drill 0.2 pad 0.36, 0.2 pad 0.41)
  Top 0.102: U1.35 10.61,11.61 v11,11.23 | v5.16,12.02 5.16,10.82 5.23,10.74 U5.5
  Route15 0.102: v5.16,12.02 6.25,12.02 7.24,13.01 7.24,13.64 7.87,14.28 8.89,14.28 9.27,13.9 9.27,13.64 10.62,12.3 10.62,11.61 v11,11.23
SPIHD  (via drill 0.2 pad 0.36, 0.2 pad 0.41)
  Top 0.102: U5.7 5.84,12.45 5.33,12.45 5.08,12.71 5.08,13.72 v4.57,14.23 | U1.30 12.62,12.33 v12.62,11.38
  Route15 0.102: v4.57,14.23 5.03,13.77 5.71,13.77 7.24,15.29 9.4,15.29 10.29,14.4 10.29,14.2 12.62,11.86 v12.62,11.38
SPIQ  (via drill 0.2 pad 0.36, 0.2 pad 0.41)
  Top 0.102: v3.17,12.33 3.43,12.33 U5.2 | U1.34 11.02,12.33 v11.02,11.71
  Route15 0.102: v3.17,12.33 3.6,12.75 5.84,12.75 7.62,14.53 9.02,14.53 9.53,14.02 9.53,13.77 11.02,12.27 v11.02,11.71
SPIWP  (via drill 0.2 pad 0.36, 0.2 pad 0.41)
  Top 0.102: U5.3 4.04,11.54 4.19,11.69 4.19,13.98 v3.94,14.23 | U1.31 v12.22,11.69
  Route15 0.102: v3.94,14.23 4.65,13.52 5.84,13.52 7.37,15.04 9.27,15.04 10.03,14.28 10.03,14.02 12.22,11.84 v12.22,11.69
USB_D+
  Top 0.102: USB.A6 9.14,14.76 8.99,14.61 8.99,14.51 9.04,14.46 9.86,14.46 10.08,14.23 12.32,14.23 12.57,13.97 12.57,13.72 R4.1 | USB.A6 | USB.A6 9.14,16.44 9.02,16.56 8.26,16.56 8.14,16.45 USB.B6
USB_D-  (via drill 0.2 pad 0.41)
  Top 0.102: USB.B7 9.64,16.58 9.27,16.94 v8.64,16.94 | v8.64,16.18 USB.A7 8.64,14.76 8.79,14.61 8.79,14.4 8.94,14.25 9.75,14.25 9.98,14.02 12.06,14.02 12.19,13.9 12.19,13.72 R3.1
  Bottom 0.102: v8.64,16.94 v8.64,16.18
VBAT  (via drill 0.2 pad 0.41)
  Top 0.254: U4.A1 8.23,13.59 v8.61,13.59 8.99,13.59 C26.1
  Top 0.356: 4.24,10.67 v4.24,10.21 4.24,10.62
  Route15 0.406: v8.61,13.59 8.33,13.59 8,13.26 8,12.75 5.46,10.21 4.7,10.21 | 4.7,10.21 v4.24,10.21 v4.24,10.65 4.7,10.21
  Bottom 0.406: 4.45,10.92 BAT.1 4.24,10.77 v4.24,10.21
  pour Top (no thermals): 3.96,9.5 3.96,10.31 4.06,10.42 4.39,10.42 4.47,10.34 4.47,9.45 4.42,9.4 4.06,9.4
VBUS  (via drill 0.2 pad 0.36, 0.2 pad 0.41)
  Top 0.152: R9.2 C10.1 | C10.1 | C10.1 4.04,9.06 | 4.04,9.06 4.13,9.06 4.22,9.15 4.7,9.15 D2.+ | Q1.2 4.04,9.06
  Top 0.203: R11.1 3.33,16.54 v3.43,16.72 | 6.98,16.97 6.81,17.15 5.05,17.15 4.83,17.38 v4.14,17.38
  Top 0.254: U4.A2 8.23,13.06 v8.56,13.06 C25.1
  Top 0.406: USB.A4_B9 11.29,15.81 10.79,16.31 10.79,17.33 | USB.B4_A9 6.49,15.81 v6.86,16.18 6.98,16.31 6.98,16.97 6.98,17.33 7.24,17.58 10.54,17.58 | 10.54,17.58 10.79,17.58 | 10.79,17.33 10.79,17.58 | J1.7 15.75,18.98 14.1,18.98 12.7,17.58 11.05,17.58 | 11.05,17.58 10.79,17.58 | D2.+ v4.91,9.71 v5.26,9.71 | 10.79,17.33 10.54,17.58 | 10.79,17.33 11.05,17.58
  Route15 0.406: v4.91,9.71 5.84,9.71 8.56,12.42 v8.56,13.06 v8.95,13.06
  Bottom 0.102: J1.7 J1.19
  Bottom 0.203: v4.14,17.38 3.68,17.38 3.48,17.17 v3.43,16.72
  Bottom 0.406: v6.86,16.18 6.6,15.93 v6.6,15.8 6.6,13.74 7.09,13.26 8.2,13.26 8.41,13.06 v8.56,13.06 v8.95,13.06
VCC_3V3  (via drill 0.2 pad 0.36, 0.2 pad 0.41)
  Top 0.102: C5.2 v5.77,8.77 | v3.11,8.23 3.05,8.23 C6.2
  Top 0.152: 16.26,14.02 16.51,13.77 J1.5 16.26,13.39 16.26,14.02 | 16.26,14.02 15.11,15.17 R15.2 R7.2 | R8.2 v2.87,14.79 | U3.A2 4.33,7.43 L4.2
  Top 0.203: U1.55 7.53,6.74 7.62,6.66 7.62,6.4 7.56,6.34 U1.56 6.92,6.34 6.63,6.05 6.63,5.44 6.44,5.25 C11.2 | v12.77,8.34 U1.20 14.52,8.34 C23.1 | U1.46 6.65,10.34 6.02,9.71 5.84,9.71 5.7,9.56 C19.2 C5.2 | C11.2 | 5.66,5.25 5.73,5.25 C12.2 5.75,5.26 v5.84,5.26 | 5.66,5.25 5.67,5.26 v6.2,5.26 6.22,5.26 C11.2 | 5.66,5.25 5.66,5.16 5.22,4.74 C9.2
  Top 0.229: 3.73,8.03 L4.2 3.53,8 3.37,8.23
  Top 0.254: v11.63,4.83 C13.2 C14.2 L1.1 | 11.68,4.83 v11.63,4.83 | 11.68,4.88 11.56,4.88 11.61,4.83 v11.63,4.83 | v11.63,4.83 11.77,4.69 C16.2 12.2,4.69 12.47,4.42 | 12.47,4.42 12.7,4.42 | 12.7,4.42 C29.2 | J3.19 12.65,4.19 | 12.65,4.19 12.83,4.37 | 12.65,4.19 12.65,4.24 12.47,4.42 | J3.18 13.05,4.07 12.7,4.42
  Top 0.406: 3.73,8.03 3.59,8.23 3.37,8.23 v3.11,8.23
  Route15 0.152: v2.87,14.79 2.41,14.33 2.41,9.63 2.77,9.27 5.51,9.27 5.77,9.02 v5.77,8.77
  Route15 0.406: v3.11,8.23 v3.49,8.23 5.23,8.23 v5.77,8.77 6.07,8.77 6.45,8.38 6.45,5.54 6.38,5.26 v6.2,5.26 v5.84,5.26
  Bottom 0.102: J1.5 J1.17
  Bottom 0.203: v12.77,8.34 12.1,8.34 12.06,8.31
  Bottom 0.254: v11.63,4.83 11.63,5.06 11.56,5.13
  Bottom 0.406: J1.5 15.49,13.13 12.83,10.47 12.45,10.47 12.06,10.09 12.06,8.31 12.06,7.42 12.32,7.17 12.32,5.92 11.56,5.16 11.56,5.13 11.05,4.57 10.95,4.68 7.9,4.68 7.31,5.26 v5.84,5.26
VDD_SPI  (via drill 0.2 pad 0.36, 0.2 pad 0.41)
  Top 0.254: U1.29 13.04,12.37 13.87,12.37 v14.45,12.96 C22.2 | v5.46,14.33 5.95,13.87 U5.8
  Route15 0.254: v5.46,14.33 5.77,14.33 7.06,15.62 9.7,15.62 11.05,14.28 12.45,14.28 13.77,12.96 v14.45,12.96
VIN  (via drill 0.2 pad 0.36, 0.2 pad 0.41, 0.25 pad 0.51)
  Top 0.102: D2.- v4.68,8.77 | U3.C2
  Top 0.152: U3.C2 5.11,7.15 v5.28,7.32
  Top 0.203: J3.15 13.85,0.92 14.5,1.58 15.24,1.58 15.52,1.3 v15.52,0.94 | C30.2 9.94,4.12 9.26,3.43 8.49,3.43 8.25,3.19 J3.30
  Top 0.229: U3.B1 4.68,6.59 4.52,6.43 | C3.1 v4.01,6.43 | v3.63,6.43 3.66,6.22 C4.1
  Top 0.254: J3.30 8.25,2.41 7.95,2.11 v7.62,2.11 v7.62,1.68 7.62,2.09
  Top 0.356: 3.79,6.43 v4.01,6.43 4.04,6.43 4.09,6.38 | 3.79,6.43 v3.63,6.43 | 3.79,6.43 3.82,6.4 | 4.52,6.43 4.47,6.38 4.09,6.38 | 4.09,6.38 3.68,6.38 3.66,6.35
  Route15 0.152: v4.01,6.43 4.39,6.43 4.8,6.02 5.38,6.02 5.59,6.22 5.59,7.01 v5.28,7.32 | 7.62,2.09 v7.62,2.11
  Route15 0.254: 7.62,2.09 7.62,0.94 7.98,0.59 15.16,0.59 v15.52,0.94
  Route15 0.406: v5.04,8.77 v4.68,8.77 2.82,8.77 2.49,8.44 2.49,6.61 2.87,6.22 3.43,6.22 v3.63,6.43 | v4.01,6.43 v3.63,6.43
  Bottom 0.406: v3.63,6.43 v4.01,6.43 4.01,4.96 5.74,3.23 7.37,3.23 7.62,2.97 v7.62,1.68
  pour Top (no thermals): 5.26,8.97 4.34,8.97 4.32,8.94 4.32,8.66 4.37,8.61 5.21,8.61 5.28,8.66 5.28,8.94

### Text on the board
tPlace: R | B
tNames: LAYER STACK-UP - ALL DIMENSIONS IN MIL | L1-L2: 4mil | 50ohm SINGLE ENDED / IMPEDANCE CONTROL +/-10% | 90ohm DIFFERENTIAL / IMPEDANCE CONTROL +/-10% | 100ohm SINGLE ENDED / IMPEDANCE CONTROL +/-10% | TRACE WIDTH | TRACE WIDTH / SPACE | TRACE WIDTH | LAYER# | COPPER WEIGHT / (OZ) | LAYER 1 - GTL | HALF+PLATING=1OZ | 5.7 | 4/4 | 13 REF:L3 | LAYER 2 - GND | HALF=0.5OZ | LAYER 3 - POWER | HALF=0.5OZ | LAYER 4 - GBL | HALF+PLATING=1OZ
bNames: VUSB | D0 | MTDI | MTDO | D1 | GND | EN | GND | D2 | MTMS | MTCK | 3V3 | D3 | D10 | BAT | D- | D+ | D4 | D9 | D8 | D5 | D6 | XIAO ESP32S3 | D7
Milling: Slot DRills with copper